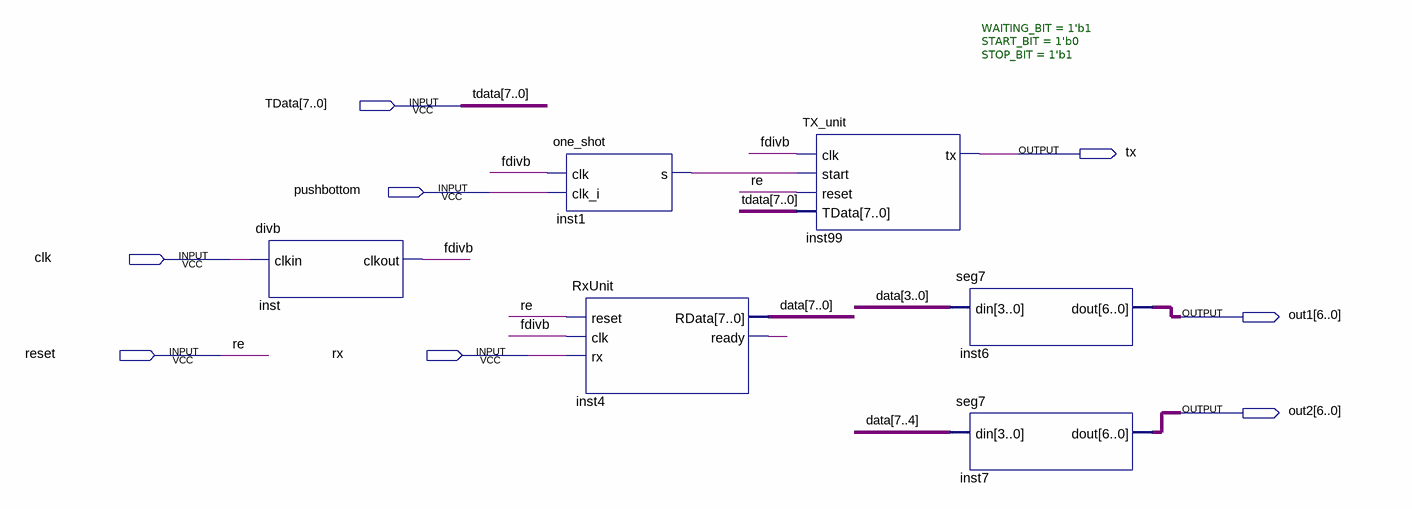
[diagram p0: schematic sheet]
// Quartus schematic week6.bdf as structural Verilog: 6 symbols, 8 pins
module week6 (
  input  [7:0] TData,
  input  pushbottom,
  input  clk,
  input  reset,
  input  rx,
  output tx,
  output [6:0] out1,
  output [6:0] out2
);

  wire fdivb, inst1_s, inst4_ready;
  wire [7:0] data;

  divb inst (.clkin(clk), .clkout(fdivb));
  one_shot inst1 (.clk(fdivb), .clk_i(pushbottom), .s(inst1_s));
  RxUnit inst4 (.reset(reset), .clk(fdivb), .rx(rx), .RData(data), .ready(inst4_ready));
  TX_unit #(.WAITING_BIT(1'b1), .START_BIT(1'b0), .STOP_BIT(1'b1)) inst99 (
    .clk(fdivb), .start(inst1_s), .reset(reset), .TData(TData), .tx(tx));
  seg7 inst6 (.din(data[3:0]), .dout(out1));
  seg7 inst7 (.din(data[7:4]), .dout(out2));

  // Other names for the same wires on the sheet: re = reset
endmodule
